# EAGLE design RaspberryPiGpioDisplayFix (EAGLE 6.5.0)
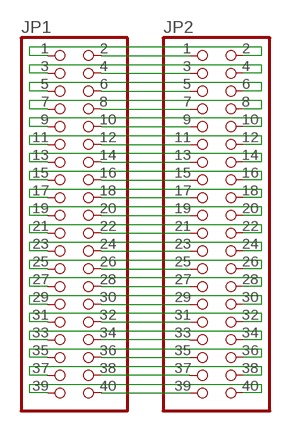
[diagram p0: schematic, sheet 1]

## Parts
JP1  PINHD-2X20  [2X20]
JP2  PINHD-2X20  [2X20]

## Nets
N$1: JP1.2 JP2.1
N$2: JP1.4 JP2.3
N$3: JP1.6 JP2.5
N$4: JP1.8 JP2.7
N$5: JP1.10 JP2.9
N$6: JP1.12 JP2.11
N$7: JP1.14 JP2.13
N$8: JP1.16 JP2.15
N$9: JP1.18 JP2.17
N$10: JP1.20 JP2.19
N$11: JP1.22 JP2.21
N$12: JP1.24 JP2.23
N$13: JP1.26 JP2.25
N$14: JP1.28 JP2.27
N$15: JP1.30 JP2.29
N$16: JP1.32 JP2.31
N$17: JP1.34 JP2.33
N$18: JP1.36 JP2.35
N$19: JP1.38 JP2.37
N$20: JP1.40 JP2.39
N$21: JP1.3 JP2.4
N$22: JP1.5 JP2.6
N$23: JP1.7 JP2.8
N$24: JP1.1 JP2.2
N$25: JP1.9 JP2.10
N$26: JP1.11 JP2.12
N$27: JP1.13 JP2.14
N$28: JP1.15 JP2.16
N$29: JP1.17 JP2.18
N$30: JP1.19 JP2.20
N$31: JP1.21 JP2.22
N$32: JP1.23 JP2.24
N$33: JP1.25 JP2.26
N$34: JP1.27 JP2.28
N$35: JP1.29 JP2.30
N$36: JP1.31 JP2.32
N$37: JP1.33 JP2.34
N$38: JP1.35 JP2.36
N$39: JP1.37 JP2.38
N$40: JP1.39 JP2.40

## Library data of the parts
JP1 JP2 = pinhead:PINHD-2X20: PIN HEADER

## Board
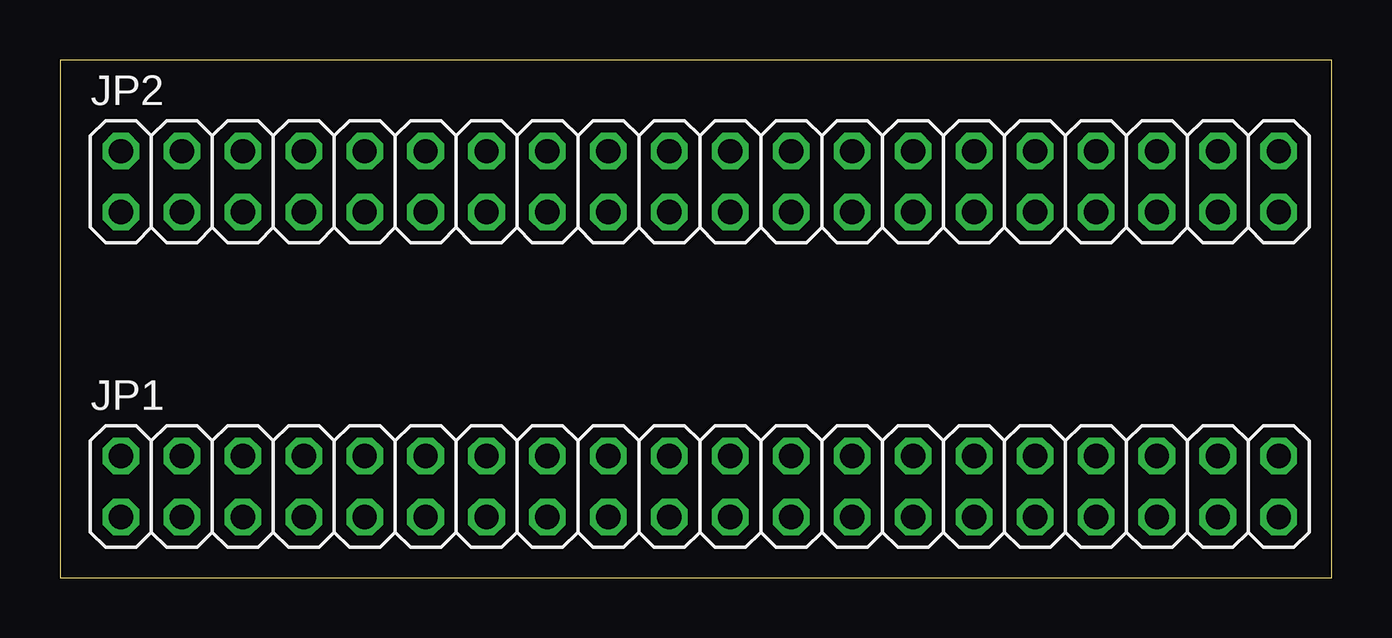
[diagram p1: board, top side]
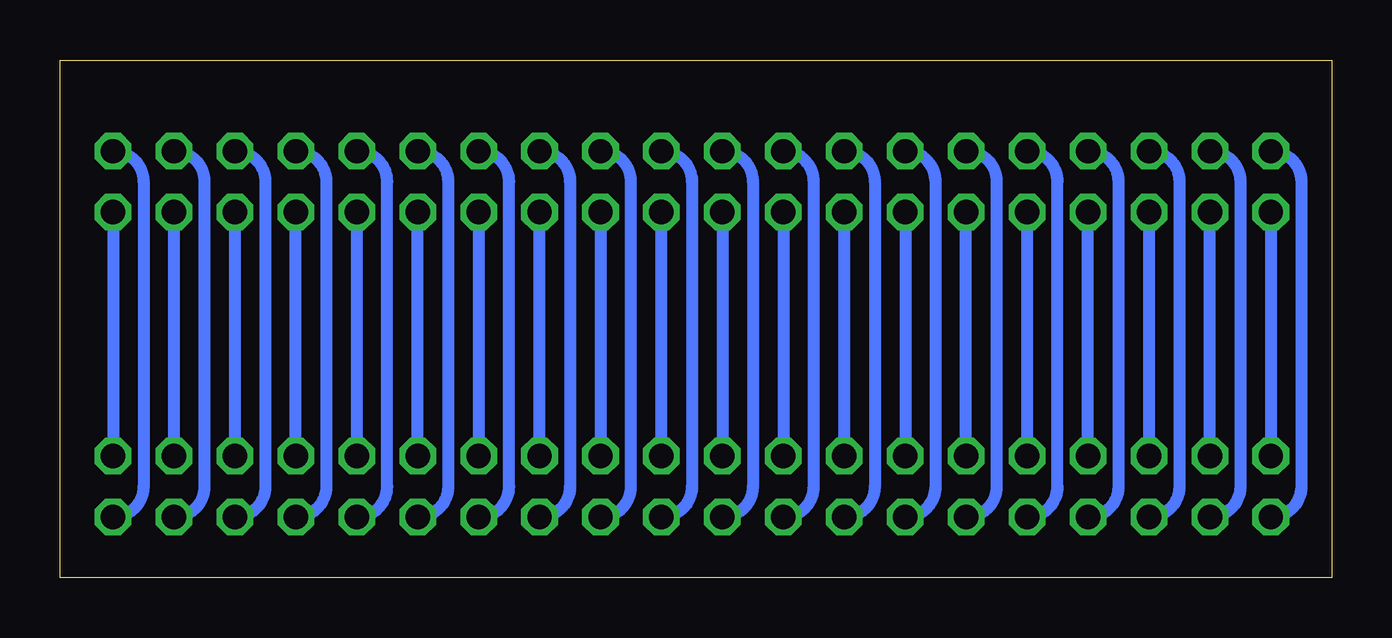
[diagram p2: board, bottom side, seen from below]

Size 53.01 x 21.58 mm. Coordinates in mm from the lower left corner, seen from the top.
Outline: 0,0 53.01,0 53.01,21.58 0,21.58 0,0
Copper layers (1*16): Top 0.035mm / dielectric 1.5mm / Bottom 0.035mm
Design rules "default": minimum track width 10mil, minimum drill 24mil, track to track 8mil, track to pad 8mil, pad to pad 8mil, via to via 8mil, smd to smd 8mil, copper to edge 40mil, drill to drill 8mil, minimum pad ring 10mil, minimum via ring 8mil, stop-mask expansion 4mil, vias tented up to drill 0mil, thermal gap 10mil

### Footprints (pad centres in the part's own frame; a part is rotated, then mirrored left to right if it is on the bottom)
2X20 = drill 1.016 octagon: 1 -24.13,-1.27; 2 -24.13,1.27; 3 -21.59,-1.27; 4 -21.59,1.27; 5 -19.05,-1.27; 6 -19.05,1.27; 7 -16.51,-1.27; 8 -16.51,1.27; 9 -13.97,-1.27; 10 -13.97,1.27; 11 -11.43,-1.27; 12 -11.43,1.27; 13 -8.89,-1.27; 14 -8.89,1.27; 15 -6.35,-1.27; 16 -6.35,1.27; 17 -3.81,-1.27; 18 -3.81,1.27; 19 -1.27,-1.27; 20 -1.27,1.27; 21 1.27,-1.27; 22 1.27,1.27; 23 3.81,-1.27; 24 3.81,1.27; 25 6.35,-1.27; 26 6.35,1.27; 27 8.89,-1.27; 28 8.89,1.27; 29 11.43,-1.27; 30 11.43,1.27; 31 13.97,-1.27; 32 13.97,1.27; 33 16.51,-1.27; 34 16.51,1.27; 35 19.05,-1.27; 36 19.05,1.27; 37 21.59,-1.27; 38 21.59,1.27; 39 24.13,-1.27; 40 24.13,1.27

### Placement (x,y rotation side)
JP1  26.67,3.81 0 top
JP2  26.67,16.51 0 top

### Tracks (layer width: path | path; a pad name or v marks a point on that pad's centre or on a via)
N$1
  Bottom 0.508: JP2.1 JP1.2
N$2
  Bottom 0.508: JP1.4 JP2.3
N$3
  Bottom 0.508: JP2.5 JP1.6
N$4
  Bottom 0.508: JP1.8 JP2.7
N$5
  Bottom 0.508: JP2.9 JP1.10
N$6
  Bottom 0.508: JP1.12 JP2.11
N$7
  Bottom 0.508: JP2.13 JP1.14
N$8
  Bottom 0.508: JP1.16 JP2.15
N$9
  Bottom 0.508: JP2.17 JP1.18
N$10
  Bottom 0.508: JP2.19 JP1.20
N$11
  Bottom 0.508: JP1.22 JP2.21
N$12
  Bottom 0.508: JP2.23 JP1.24
N$13
  Bottom 0.508: JP1.26 JP2.25
N$14
  Bottom 0.508: JP2.27 JP1.28
N$15
  Bottom 0.508: JP1.30 JP2.29
N$16
  Bottom 0.508: JP2.31 JP1.32
N$17
  Bottom 0.508: JP1.34 JP2.33
N$18
  Bottom 0.508: JP2.35 JP1.36
N$19
  Bottom 0.508: JP1.38 JP2.37
N$20
  Bottom 0.508: JP2.39 JP1.40
N$21
  Bottom 0.508: JP2.4 arc90 3.81,16.51 3.81,3.81 arc90 JP1.3
N$22
  Bottom 0.508: JP2.6 arc90 6.35,16.51 6.35,3.81 arc90 JP1.5
N$23
  Bottom 0.508: JP2.8 arc90 8.89,16.51 8.89,3.81 arc90 JP1.7
N$24
  Bottom 0.508: JP2.2 arc90 1.27,16.51 1.27,3.81 arc90 JP1.1
N$25
  Bottom 0.508: JP1.9 arc-90 11.43,3.81 11.43,16.51 arc-90 JP2.10
N$26
  Bottom 0.508: JP2.12 arc90 13.97,16.51 13.97,3.81 arc90 JP1.11
N$27
  Bottom 0.508: JP1.13 arc-90 16.51,3.81 16.51,16.51 arc-90 JP2.14
N$28
  Bottom 0.508: JP2.16 arc90 19.05,16.51 19.05,3.81 arc90 JP1.15
N$29
  Bottom 0.508: JP1.17 arc-90 21.59,3.81 21.59,16.51 arc-90 JP2.18
N$30
  Bottom 0.508: JP2.20 arc90 24.13,16.51 24.13,3.81 arc90 JP1.19
N$31
  Bottom 0.508: JP2.22 arc90 26.67,16.51 26.67,3.81 arc90 JP1.21
N$32
  Bottom 0.508: JP1.23 arc-90 29.21,3.81 29.21,16.51 arc-90 JP2.24
N$33
  Bottom 0.508: JP2.26 arc90 31.75,16.51 31.75,3.81 arc90 JP1.25
N$34
  Bottom 0.508: JP1.27 arc-90 34.29,3.81 34.29,16.51 arc-90 JP2.28
N$35
  Bottom 0.508: JP2.30 arc90 36.83,16.51 36.83,3.81 arc90 JP1.29
N$36
  Bottom 0.508: JP1.31 arc-90 39.37,3.81 39.37,16.51 arc-90 JP2.32
N$37
  Bottom 0.508: JP2.34 arc90 41.91,16.51 41.91,3.81 arc90 JP1.33
N$38
  Bottom 0.508: JP2.36 arc90 44.45,16.51 44.45,3.81 arc90 JP1.35
N$39
  Bottom 0.508: JP2.38 arc90 46.99,16.51 46.99,3.81 arc90 JP1.37
N$40
  Bottom 0.508: JP2.40 arc90 49.53,16.51 49.53,3.81 arc90 JP1.39